# EAGLE design SiliconMind (EAGLE 8.3.2)
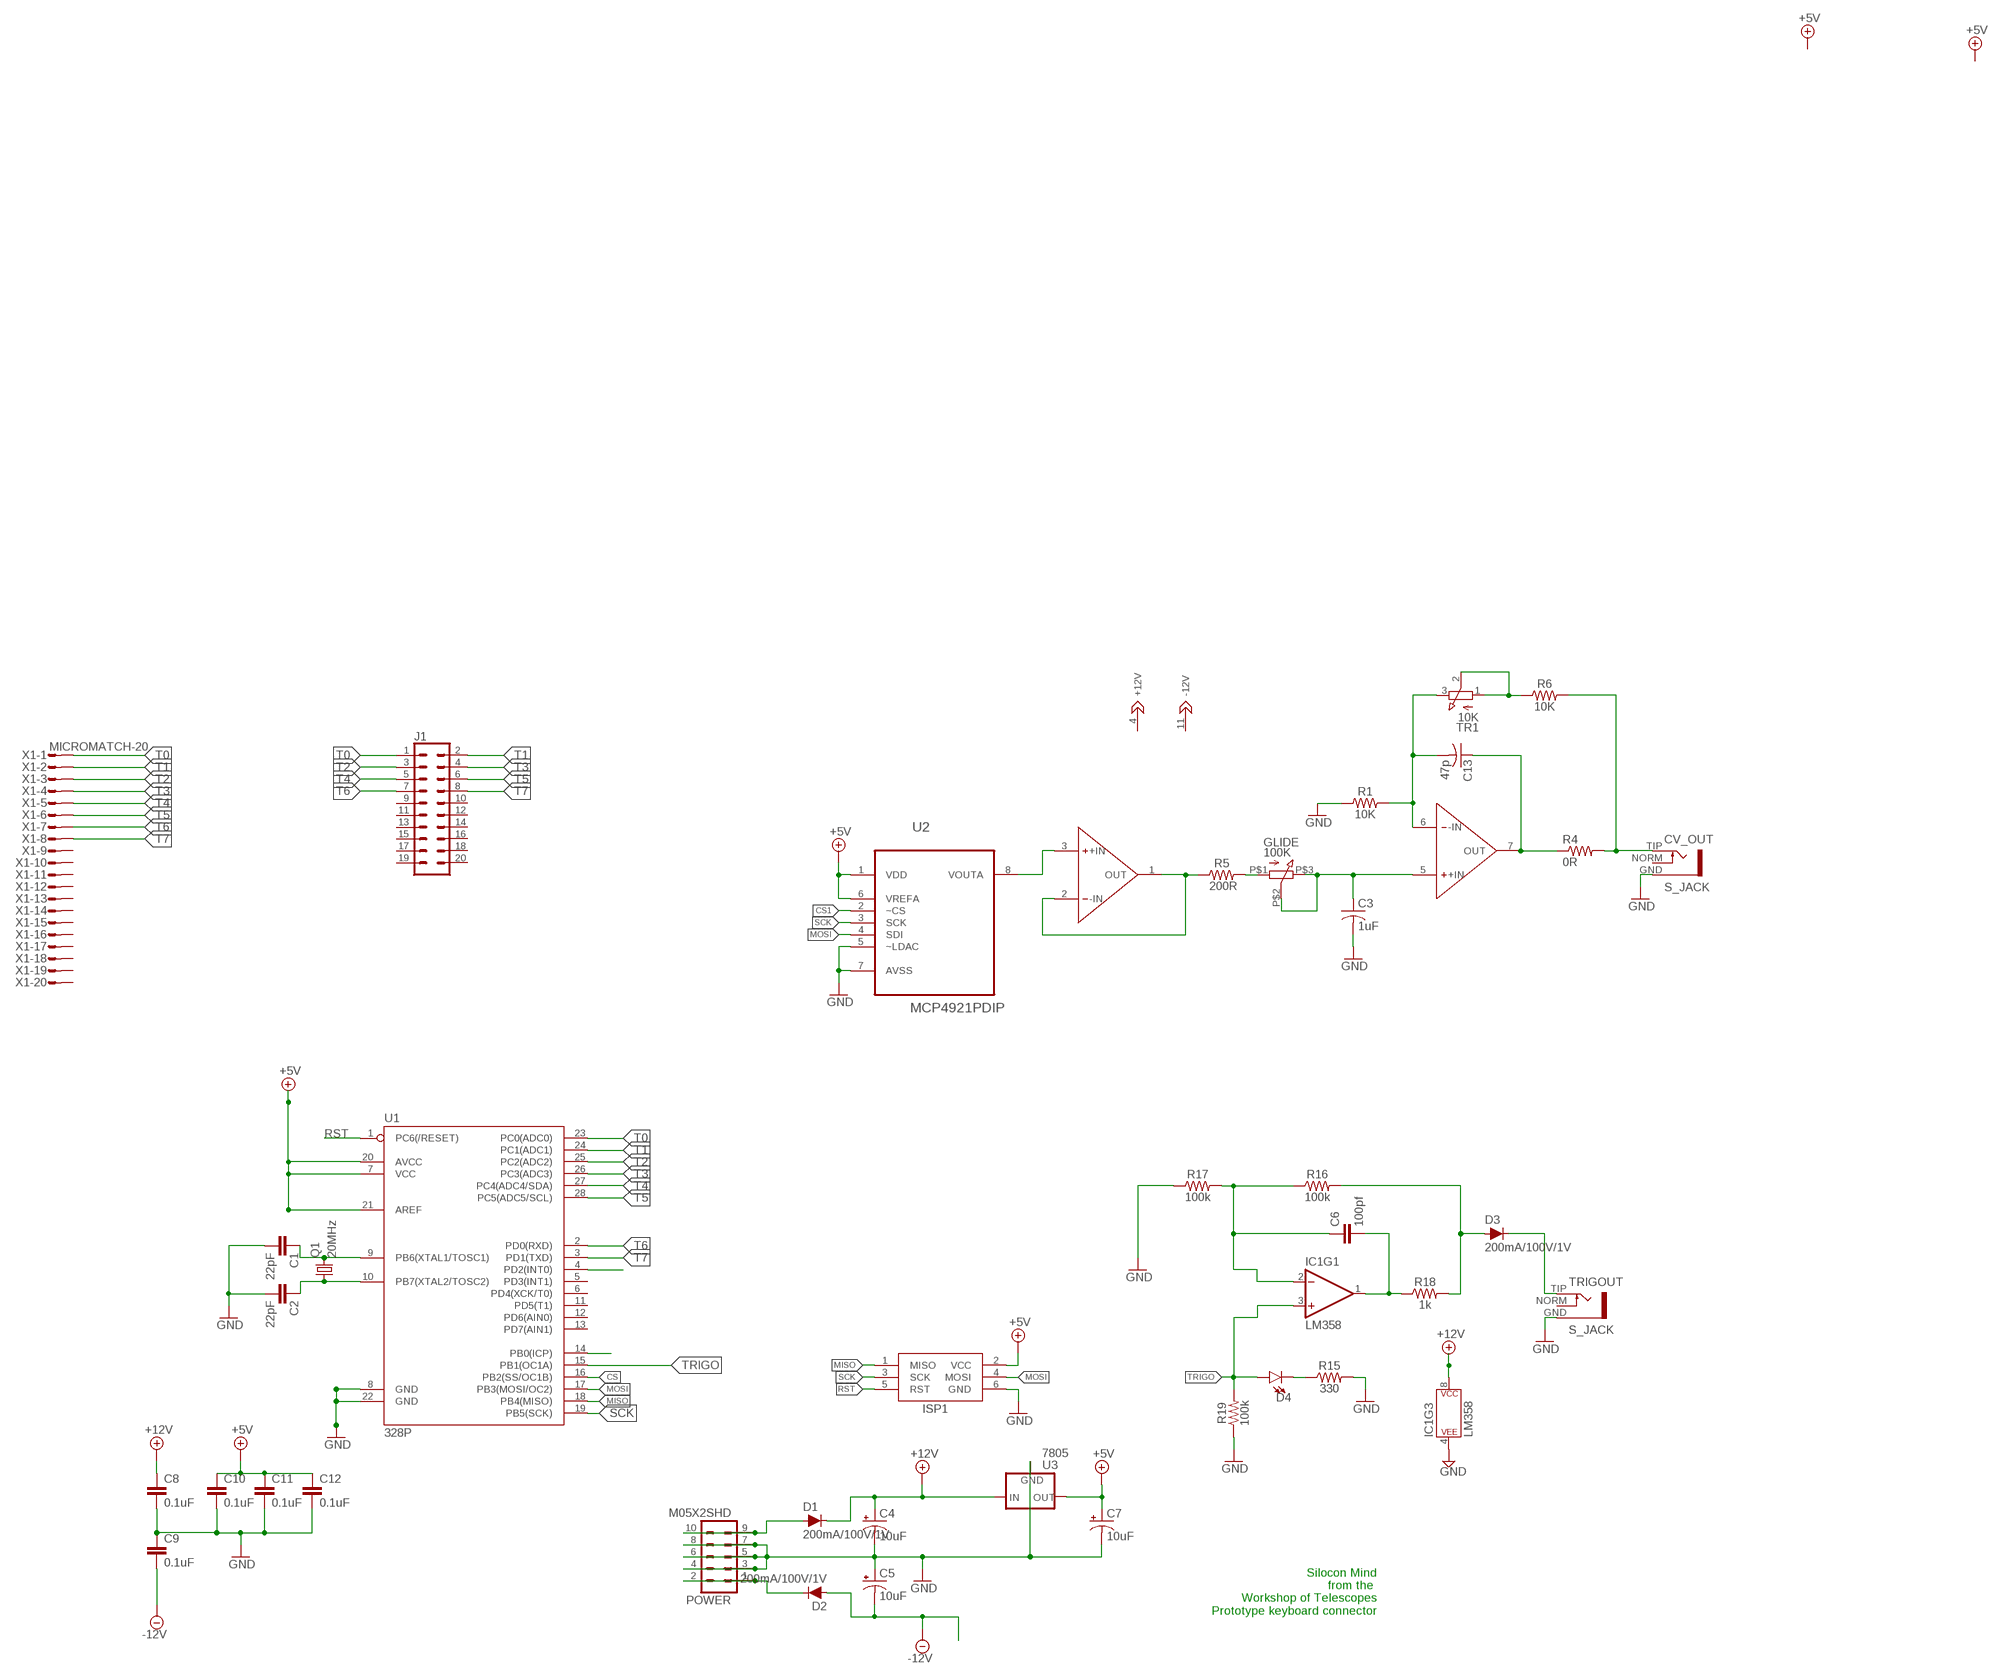
[diagram p0: schematic, sheet 1]

## Parts
C1  22pF  22PF-PTH-2.54MM-200V-5%  [CAP-PTH-2.54]
C2  22pF  22PF-PTH-2.54MM-200V-5%  [CAP-PTH-2.54]
C3  1uF  C-USC0805K  [C0805K]
C4  10uF  10UF-POLAR-RADIAL-2.5MM-25V-20%  [CPOL-RADIAL-2.5MM-5MM]
C5  10uF  10UF-POLAR-RADIAL-2.5MM-25V-20%  [CPOL-RADIAL-2.5MM-5MM]
C6  100pf  C-EU075-032X103  [C075-032X103]
C7  10uF  10UF-POLAR-RADIAL-2.5MM-25V-20%  [CPOL-RADIAL-2.5MM-5MM]
C8  0.1uF  0.1UF-KIT-EZ-50V-20%  [CAP-PTH-SMALL-KIT]
C9  0.1uF  0.1UF-KIT-EZ-50V-20%  [CAP-PTH-SMALL-KIT]
C10  0.1uF  0.1UF-KIT-EZ-50V-20%  [CAP-PTH-SMALL-KIT]
C11  0.1uF  0.1UF-KIT-EZ-50V-20%  [CAP-PTH-SMALL-KIT]
C12  0.1uF  0.1UF-KIT-EZ-50V-20%  [CAP-PTH-SMALL-KIT]
C13  47p  C-USC0805K  [C0805K]
CV_OUT  S_JACK  [S_JACK]
D1  200mA/100V/1V  DIODE-1N4148  [DIODE-1N4148]
D2  200mA/100V/1V  DIODE-1N4148  [DIODE-1N4148]
D3  200mA/100V/1V  DIODE-1N4148  [DIODE-1N4148]
D4  LED3MM  [LED_3MM]
GLIDE  100K  Q-POT  [Q-POT]
IC1  LM358  [DIP08]
ISP1  AVRISP-6  [AVRISP]
J1  CONN_10X2  [2X10]
POWER  M05X2SHD  [2X5-SHROUDED]
Q1  20MHz  CRYSTALHC49U70  [HC49U70]
R1  10K  RESISTORAXIAL-0.3  [AXIAL-0.3]
R4  0R  R-US_R0805  [R0805]
R5  200R  RESISTORAXIAL-0.3  [AXIAL-0.3]
R6  10K  RESISTORAXIAL-0.3  [AXIAL-0.3]
R15  330  330OHM-HORIZ-1/10W-5%  [AXIAL-0.3]
R16  100k  100KOHM-HORIZ-1/4W-5%  [AXIAL-0.3]
R17  100k  100KOHM-HORIZ-1/4W-5%  [AXIAL-0.3]
R18  1k  1KOHM-HORIZ-1/4W-5%  [AXIAL-0.3]
R19  100k  100KOHM-HORIZ-1/4W-5%  [AXIAL-0.3]
TR1  10K  TRIM_3269W  [TRIM_3269W]
TRIGOUT  S_JACK  [S_JACK]
U1  328P  ATMEGA328P_PDIP  [DIP28]
U2  MCP4921PDIP  [DIP08]
U3  7805  V_REG_78XX-TO-220  [TO-220-ALT]
U4  QUAD_OPAMPDIP14  [DIP254P762X533-14]
X1  MICROMATCH-20  [MICROMATCH-20]

## Nets
+5V [Power]: C7.1(+) C10.1 C11.1 C12.1 ISP1.2(VCC) U1.7(VCC) U1.20(AVCC) U1.21(AREF) U2.1(VDD) U2.6(VREFA) U3.OUT
+12V [Power]: C4.1(+) C8.1 D1.C IC1.8(P$V+) U3.IN
-12V [Power]: C5.2(-) C9.2 D2.A
BUTLED: U1.15(PB1(OC1A))
CS: U1.16(PB2(SS/OC1B))
CS1: U2.2(~CS)
GND [Power]: C1.2 C2.2 C3.2 C4.2(-) C5.1(+) C7.2(-) C8.2 C9.1 C10.2 C11.2 C12.2 CV_OUT.GND IC1.4(P$V-) ISP1.6(GND) POWER.3 POWER.4 POWER.5 POWER.6 POWER.7 POWER.8 R1.P$1 R15.P$2 R17.P$1 R19.P$1 TRIGOUT.GND U1.8(GND) U1.22(GND) U2.5(~LDAC) U2.7(AVSS) U3.GND
MISO: ISP1.1(MISO) U1.18(PB4(MISO))
MOSI: ISP1.4(MOSI) U1.17(PB3(MOSI/OC2)) U2.4(SDI)
N$1: C1.1 Q1.2 U1.9(PB6(XTAL1/TOSC1))
N$2: C2.1 Q1.1 U1.10(PB7(XTAL2/TOSC2))
N$3: U2.8(VOUTA) U4.3(+IN)
N$4: R5.P$1 U4.1(OUT) U4.2(-IN)
N$5: GLIDE.P$1 R5.P$2
N$6: C3.1 GLIDE.P$2 GLIDE.P$3 U4.5(+IN)
N$7: R6.P$1 TR1.1 TR1.2
N$8: CV_OUT.TIP R4.2 R6.P$2
N$9: D1.A POWER.9 POWER.10
N$10: D2.C POWER.1 POWER.2
N$11: C13.1 R4.1 U4.7(OUT)
N$12: C13.2 R1.P$2 TR1.3 U4.6(-IN)
N$17: U1.4(PD2(INT0))
N$31: D4.K(C) R15.P$1
N$32: C6.1 IC1.2(-IN) R16.P$1 R17.P$2
N$33: C6.2 IC1.1(OUT) R18.P$1
N$34: D3.A R16.P$2 R18.P$2
N$74: D3.C TRIGOUT.TIP
RST: ISP1.5(RST) U1.1(PC6(/RESET))
SCK: ISP1.3(SCK) U1.19(PB5(SCK)) U2.3(SCK)
T0: J1.1 U1.23(PC0(ADC0)) X1.1
T1: J1.2 U1.24(PC1(ADC1)) X1.2
T2: J1.3 U1.25(PC2(ADC2)) X1.3
T3: J1.4 U1.26(PC3(ADC3)) X1.4
T4: J1.5 U1.27(PC4(ADC4/SDA)) X1.5
T5: J1.6 U1.28(PC5(ADC5/SCL)) X1.6
T6: J1.7 U1.2(PD0(RXD)) X1.7
T7: J1.8 U1.3(PD1(TXD)) X1.8
TRIGO: D4.A IC1.3(+IN) R19.P$2 U1.14(PB0(ICP))
Unconnected: CV_OUT.NORM IC1.5(+IN) IC1.6(-IN) IC1.7(OUT) J1.9 J1.10 J1.11 J1.12 J1.13 J1.14 J1.15 J1.16 J1.17 J1.18 J1.19 J1.20 TRIGOUT.NORM U1.5(PD3(INT1)) U1.6(PD4(XCK/T0)) U1.11(PD5(T1)) U1.12(PD6(AIN0)) U1.13(PD7(AIN1)) U4.4(+12V) U4.8(OUT) U4.9(-IN) U4.10(+IN) U4.11(-12V) U4.12(+IN) U4.13(-IN) U4.14(OUT) X1.9 X1.10 X1.11 X1.12 X1.13 X1.14 X1.15 X1.16 X1.17 X1.18 X1.19 X1.20

## Notes on the sheet
- Silocon Mind
  from the 
  Workshop of Telescopes
  Prototype keyboard connector

## Library data of the parts
C1 C2 = SparkFun-Capacitors:22PF: 22pF ceramic capacitors A capacitor is a passive two-terminal electrical component used to store electrical energy temporarily in an electric field.; PROD_ID: CAP-09128
C3 C13 = rcl:C-US: CAPACITOR, American symbol
C4 C5 C7 = SparkFun-Capacitors:10UF-POLAR: 10.0µF polarized capacitors A capacitor is a passive two-terminal electrical component used to store electrical energy temporarily in an electric field.; PROD_ID: CAP-08440
C6 = rcl:C-EU: CAPACITOR, European symbol
C8-C12 = SparkFun-Capacitors:0.1UF: 0.1µF ceramic capacitors A capacitor is a passive two-terminal electrical component used to store electrical energy temporarily in an electric field.; PROD_ID: CAP-08370
CV_OUT TRIGOUT = INSTRUO:S_JACK
D1-D3 = SparkFun-DiscreteSemi:DIODE: Diode These are standard reverse protection diodes and small signal diodes. SparkFun Products: SparkFun SparkPunk Sound Kit <https://www.sparkfun.com/products/11177> SparkFun ESP8266 Thing <https://www.sparkfun.com/products/13231>; PROD_ID: DIO-08378
D4 = SparkFun-LED:LED: LED (Generic) Standard schematic elements and footprints for 5mm, 3mm, 1206, and 0603 sized LEDs. Generic LEDs with no color specified.; PROD_ID: DIO-08794
GLIDE = INSTRUO:Q-POT
IC1 = SparkFun-IC-Amplifiers:LM358: LM358 Jellybean op-amp Datasheet <http://www.sparkfun.com/datasheets/Components/General/LM358.pdf> SparkFun Products Op-Amp (Thru-Hole) - LM358 <https://www.sparkfun.com/products/9456> (COM-09456); PROD_ID: IC-09172
ISP1 = adafruit:AVRISP: AVR ISP HEADER Standard 6 pin header for AVR programming
J1 = SparkFun-Connectors:CONN_10X2: Multi connection point. Often used as Generic Header-pin footprint for 0.1 inch spaced/style header connections On any of the 0.1 inch spaced packages, you can populate with these: Break Away Headers - Straight <https://www.sparkfun.com/products/116> (PRT-00116) Break Away Male Headers - Right Angle <https://www.sparkfun.com/products/553> (PRT-00553) Female Headers <https://www.sparkfun.com/products/115> (PRT-00115) Break Away Headers - Machine Pin <https://www.sparkfun.com/products/117> (PRT-00117) Break Away Female Headers - Swiss Machine Pin <https://www.sparkfun.com/products/743> (PRT-00743) Special note about the "SPECIAL" package: This was SPECIALLY designed to be used with our Graphic LCD Backpack. Be sure you want to use this! It is not only staggered on each line of header holes, but IT IS ALSO offset of the center point of the top and bottom lines by 5 mil. This causes the headers to lock into place on the "standard" footprint on the LCD screen. The extra squares on the tdocu layer are there simply to reference other pins (if you were to actually populate a longer header than ten long - this is what we do with the backpacks).
POWER = SparkFun-Connectors:M05X2: Header 5x2 Standard 10-pin dual row 0.1" header. Commonly used with AVR-ISP. Use with Spark Fun Electronics SKU: PRT-00778
Q1 = adafruit:CRYSTAL: CRYSTAL; OC_FARNELL: unknown; OC_NEWARK: unknown
R1 R5 R6 = SparkFun-Resistors:RESISTOR: Generic Resistor Package
R4 = rcl:R-US_: RESISTOR, American symbol
R15 = SparkFun-Resistors:330OHM: 330Ω resistor A resistor is a passive two-terminal electrical component that implements electrical resistance as a circuit element. Resistors act to reduce current flow, and, at the same time, act to lower voltage levels within circuits. - Wikipedia; PROD_ID: RES-8371
R16 R17 R19 = SparkFun-Resistors:100KOHM: 100kΩ resistor A resistor is a passive two-terminal electrical component that implements electrical resistance as a circuit element. Resistors act to reduce current flow, and, at the same time, act to lower voltage levels within circuits. - Wikipedia; PROD_ID: RES-10686
R18 = SparkFun-Resistors:1KOHM: 1kΩ resistor A resistor is a passive two-terminal electrical component that implements electrical resistance as a circuit element. Resistors act to reduce current flow, and, at the same time, act to lower voltage levels within circuits. - Wikipedia; PROD_ID: RES-08380
TR1 = INSTRUO:TRIM_3269W: Manufacturer Part #: 3269W-1-101GLF
U1 = SparkFun-IC-Microcontroller:ATMEGA328P_PDIP: Atmel 328P Through hole ATMEGA328P uC used in the Arduino 32kb flash, 1k EEPROM, 2k SRAM Datasheet <http://www.sparkfun.com/datasheets/Components/SMD/ATMega328.pdf> SparkFun Products Storefront component: AVR 28 Pin 20MHz 32K 6A/D - ATMega328P <https://www.sparkfun.com/products/9061> (COM-09061) SparkFun Simon Says - Through-Hole Soldering Kit <https://www.sparkfun.com/products/10547> (KIT-10547) SparkFun Learn to Solder - Simon Says <https://www.sparkfun.com/products/13708> (KIT-13708) SparkFun BigTime Watch Kit <https://www.sparkfun.com/products/11734> (KIT-11734) SparkFun ClockIt <https://www.sparkfun.com/products/10930> (KIT-10930) SparkFun Serial Enabled LCD Kit <https://www.sparkfun.com/products/10097> (LCD-10097) SparkFun Simon Tilts - Through Hole Soldering Kit <https://www.sparkfun.com/products/12634> (KIT-12634) SparkFun Frequency Counter Kit <https://www.sparkfun.com/products/10140> (KIT-10140) FabFM Radio Kit <https://www.sparkfun.com/products/11043> (KIT-11043) SparkFun Binary Blaster Kit <https://www.sparkfun.com/products/12037> (KIT-12037) SparkFun Metro-Gnome <https://www.sparkfun.com/products/9236> (KIT-09236) ATmega328 with Arduino Optiboot (Uno) <https://www.sparkfun.com/products/10524> (DEV-10524); PROD_ID: IC-09136
U2 = INSTRUO:MCP4921
U3 = SparkFun-IC-Power:V_REG_78XX: Voltage Regulator Standard 78xx regulator. IGO (Input Ground Output). Spark Fun Electronics SKU : COM-00107; PROD_ID: VREG-08450; SF_ID: COM-00107
U4 = INSTRUO:QUAD_OPAMP
X1 = con-amp-micromatch:MICROMATCH-20: MicroMaTch 20 9-215464-0 / 2-215464-0 Drawing Number C-215464 DDEController.pdf; MF: FARNELL; MPN: 9-215464-0; OC_FARNELL: 3784708; OC_NEWARK: 19J6798

## Net classes
1 Power: width 0.8 mm

## Board
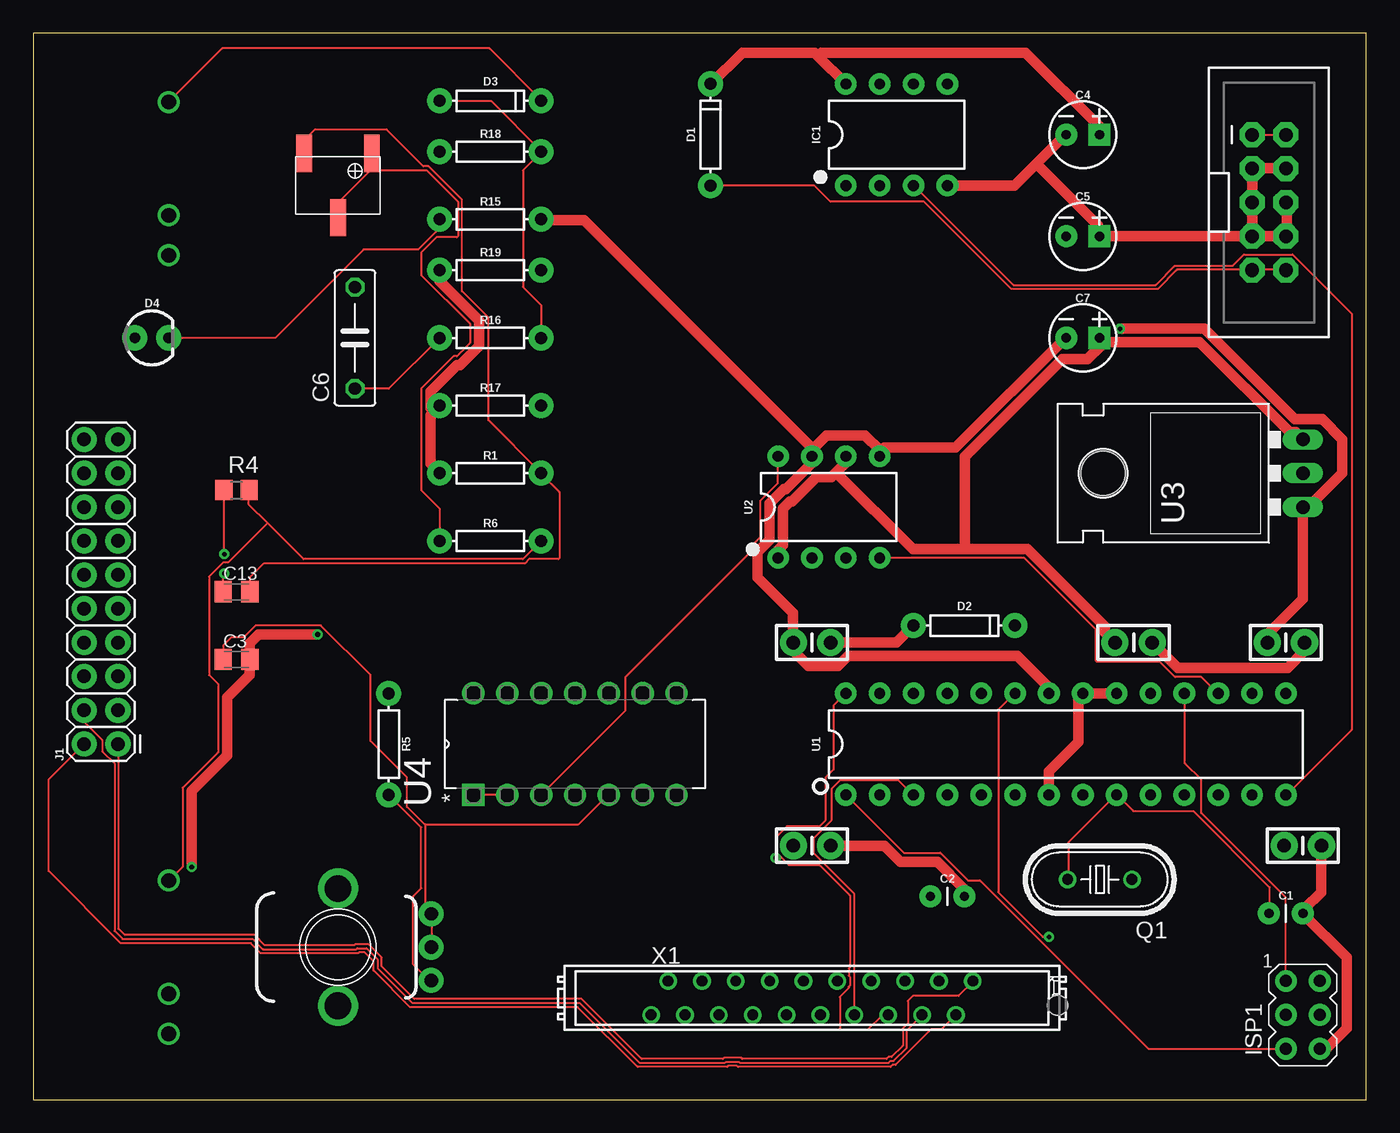
[diagram p1: board, top side]
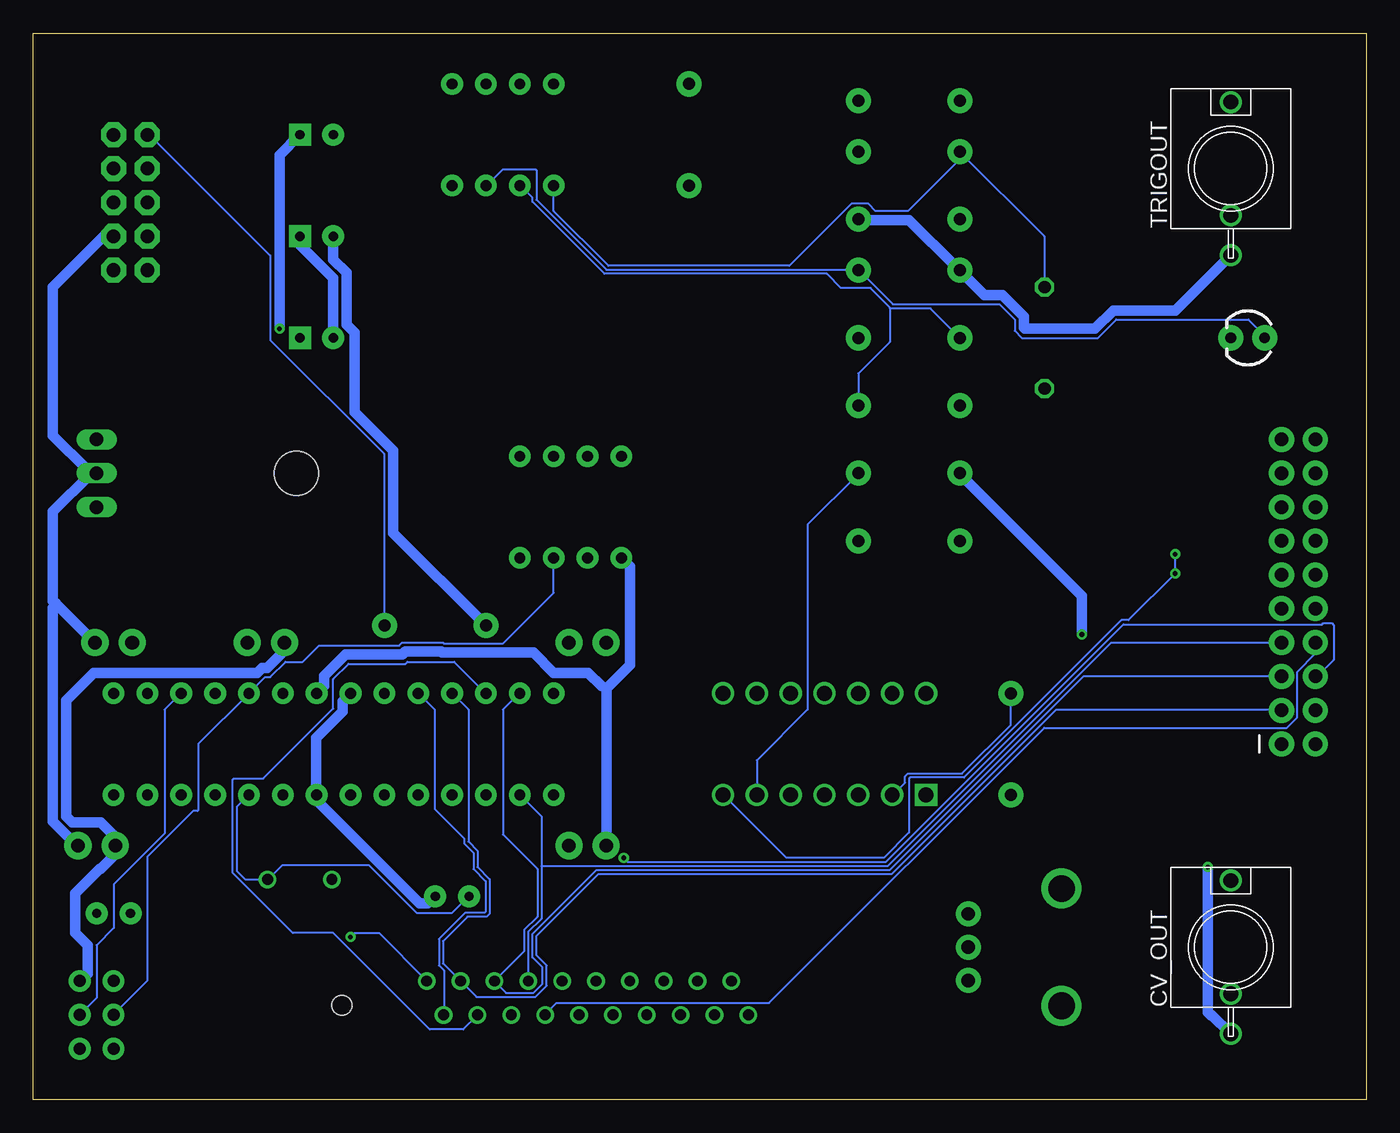
[diagram p2: board, bottom side, seen from below]

Size 100 x 80 mm. Coordinates in mm from the lower left corner, seen from the top.
Outline: 0,0 100,0 100,80 0,80 0,0
Copper layers (1*16): Top 0.035mm / dielectric 1.5mm / Bottom 0.035mm
Design rules "default": minimum track width 6mil, minimum drill 0.35mm, track to track 6mil, track to pad 6mil, pad to pad 6mil, via to via 6mil, smd to smd 6mil, copper to edge 40mil, drill to drill 6mil, minimum pad ring 10mil, minimum via ring 8mil, stop-mask expansion 4mil, vias tented up to drill 0mil, thermal gap 10mil

### Footprints (pad centres in the part's own frame; a part is rotated, then mirrored left to right if it is on the bottom)
CAP-PTH-2.54 = drill 0.7 pad 1.651: 1 -1.27,0; 2 1.27,0
C0805K = smd 1.3 x 1.6: 1 -1,0; 2 1,0
CPOL-RADIAL-2.5MM-5MM = drill 0.7 pad 1.651 square: 1 1.25,0 | drill 0.7 pad 1.651: 2 -1.25,0
C075-032X103 = drill 0.914 octagon: 1 -3.81,0; 2 3.81,0
CAP-PTH-SMALL-KIT = drill 1.016 pad 2.032: 1 -1.397,0; 2 1.397,0
S_JACK = drill 1.1: GND 0,-6.5; NORM 0,-3.5; TIP 0,5
DIODE-1N4148 = drill 0.9 pad 1.88: A -3.81,0; C 3.81,0
LED_3MM = drill 0.813 pad 1.88: A -1.27,0; K 1.27,0
Q-POT = drill 1 pad 1.88: P$1 -2.5,-7; P$2 0,-7; P$3 2.5,-7 | drill 2 pad 2.68: P$4 -4.4,0; P$5 4.4,0
DIP08 = drill 0.813 pad 1.626: 1 -3.81,-3.81; 2 -1.27,-3.81; 3 1.27,-3.81; 4 3.81,-3.81; 5 3.81,3.81; 6 1.27,3.81; 7 -1.27,3.81; 8 -3.81,3.81
AVRISP = drill 0.9 pad 1.626: 1 -1.27,2.54; 2 1.27,2.54; 3 -1.27,0; 4 1.27,0; 5 -1.27,-2.54; 6 1.27,-2.54
2X10 = drill 1.016 pad 1.88: 1 0,0; 2 0,2.54; 3 2.54,0; 4 2.54,2.54; 5 5.08,0; 6 5.08,2.54; 7 7.62,0; 8 7.62,2.54; 9 10.16,0; 10 10.16,2.54; 11 12.7,0; 12 12.7,2.54; 13 15.24,0; 14 15.24,2.54; 15 17.78,0; 16 17.78,2.54; 17 20.32,0; 18 20.32,2.54; 19 22.86,0; 20 22.86,2.54
2X5-SHROUDED = drill 1.016 pad 1.88 octagon: 1 -1.27,5.08; 2 1.27,5.08; 3 -1.27,2.54; 4 1.27,2.54; 5 -1.27,0; 6 1.27,0; 7 -1.27,-2.54; 8 1.27,-2.54; 9 -1.27,-5.08; 10 1.27,-5.08
HC49U70 = drill 0.813: 1 -2.413,0; 2 2.413,0
AXIAL-0.3 = drill 0.9 pad 1.88: P$1 -3.81,0; P$2 3.81,0
R0805 = smd 1.3 x 1.5: 1 -0.95,0; 2 0.95,0
TRIM_3269W = smd 1.19 x 2.79: 1 2.54,2.414; 2 0,-2.414; 3 -2.54,2.414
DIP28 = drill 0.813 pad 1.626: 1 -16.51,-3.81; 2 -13.97,-3.81; 3 -11.43,-3.81; 4 -8.89,-3.81; 5 -6.35,-3.81; 6 -3.81,-3.81; 7 -1.27,-3.81; 8 1.27,-3.81; 9 3.81,-3.81; 10 6.35,-3.81; 11 8.89,-3.81; 12 11.43,-3.81; 13 13.97,-3.81; 14 16.51,-3.81; 15 16.51,3.81; 16 13.97,3.81; 17 11.43,3.81; 18 8.89,3.81; 19 6.35,3.81; 20 3.81,3.81; 21 1.27,3.81; 22 -1.27,3.81; 23 -3.81,3.81; 24 -6.35,3.81; 25 -8.89,3.81; 26 -11.43,3.81; 27 -13.97,3.81; 28 -16.51,3.81
TO-220-ALT = drill 1.016 long: GND 0,-3.81; IN -2.54,-3.81; OUT 2.54,-3.81 | hole 3.302: 0,11.176
DIP254P762X533-14 = drill 1.118 square: 1 -7.62,15.24 | drill 1.118: 2 -7.62,12.7; 3 -7.62,10.16; 4 -7.62,7.62; 5 -7.62,5.08; 6 -7.62,2.54; 7 -7.62,0; 8 0,0; 9 0,2.54; 10 0,5.08; 11 0,7.62; 12 0,10.16; 13 0,12.7; 14 0,15.24
MICROMATCH-20 = drill 0.813: 1 12.065,1.27; 2 10.795,-1.27; 3 9.525,1.27; 4 8.255,-1.27; 5 6.985,1.27; 6 5.715,-1.27; 7 4.445,1.27; 8 3.175,-1.27; 9 1.905,1.27; 10 0.635,-1.27; 11 -0.635,1.27; 12 -1.905,-1.27; 13 -3.175,1.27; 14 -4.445,-1.27; 15 -5.715,1.27; 16 -6.985,-1.27; 17 -8.255,1.27; 18 -9.525,-1.27; 19 -10.795,1.27; 20 -12.065,-1.27 | hole 1.5: 18.43,-0.55

### Placement (x,y rotation side)
C1  93.98,13.97 0 top
C2  68.58,15.24 0 top
C3  15.24,33.02 0 top
C4  78.74,72.39 0 top
C5  78.74,64.77 0 top
C6  24.13,57.15 90 top
C7  78.74,57.15 0 top
C8  93.98,34.29 0 top
C9  58.42,34.29 0 top
C10  58.42,19.05 0 top
C11  95.25,19.05 0 top
C12  82.55,34.29 0 top
C13  15.24,38.1 0 top
CV_OUT  10.16,11.43 0 bottom
D1  50.8,72.39 90 top
D2  69.85,35.56 0 top
D3  34.29,74.93 0 top
D4  8.89,57.15 0 top
GLIDE  22.86,11.43 90 top
IC1  64.77,72.39 0 top
ISP1  95.25,6.35 0 top
J1  6.35,26.67 90 top
POWER  92.71,67.31 0 top
Q1  80.01,16.51 180 top
R1  34.29,46.99 0 top
R4  15.24,45.72 0 top
R5  26.67,26.67 270 top
R6  34.29,41.91 0 top
R15  34.29,66.04 0 top
R16  34.29,57.15 0 top
R17  34.29,52.07 0 top
R18  34.29,71.12 0 top
R19  34.29,62.23 0 top
TR1  22.86,68.58 0 top
TRIGOUT  10.16,69.85 0 bottom
U1  77.47,26.67 0 top
U2  59.69,44.45 0 top
U3  91.44,46.99 90 top
U4  48.26,30.48 90 top
X1  58.42,7.62 0 top

### Tracks (layer width: path | path; a pad name or v marks a point on that pad's centre or on a via)
+5V
  Top 0.8: U3.OUT 94.72,50.06 94.26,50.06 87.48,56.84 80.31,56.84 80.01,57.15 C7.1 80.09,56.54 79.1,55.55 77.19,55.55 69.88,48.23 69.88,41.3 | U1.7 76.2,24.61 78.41,26.82 78.41,30.18 78.72,30.48 U1.21 U1.20 | 60.24,47.05 60.96,47.78 U2.6 | 60.24,47.05 59.89,46.71 58.75,46.71 56.92,44.88 56.77,44.88 56.24,44.35 56.24,41.6 55.85,41.22 55.85,40.69 U2.1 | C12.1 80.39,35.05 80.39,35.51 74.6,41.3 69.88,41.3 | 69.88,41.3 65.99,41.3 60.24,47.05
  Bottom 0.8: ISP1.2 96.47,8.91 95.94,9.45 95.94,11.58 96.85,12.5 96.85,15.47 95.02,17.3 94.94,17.3 93.88,18.36 93.88,19.05 C11.1 94.03,19.43 94.03,19.89 94.94,20.8 97.08,20.8 97.54,21.26 97.54,29.95 95.48,32 83.21,32 82.83,32.38 82.45,32.38 81.15,33.68 C12.1 | 57,30.86 57,19.05 C10.1 | 57,30.86 55.24,32.61 55.24,40.01 U2.1 | U1.21 78.72,30.48 78.18,31.01 78.18,31.77 76.58,33.38 72.31,33.38 72.08,33.6 69.42,33.6 69.34,33.53 62.48,33.53 60.96,32 58.37,32 57.38,31.01 57,30.86
+12V  (via drill 0.35)
  Top 0.8: C8.1 92.58,34.9 95.25,37.57 U3.IN 95.63,44.58 95.78,44.58 98.22,47.02 98.22,49.53 96.7,51.05 94.64,51.05 87.86,57.84 v81.53,57.84 | 58.86,78.3 58.6,78.56 53.19,78.56 50.83,76.2 D1.C | 58.86,78.3 IC1.8 | C4.1 79.93,72.39 79.93,73.08 74.45,78.56 59.13,78.56 58.86,78.3
  Bottom 0.8: v81.53,57.84 81.53,70.87 80.01,72.39 C4.1
-12V
  Top 0.8: C9.2 64.77,34.29 D2.A
  Bottom 0.8: D2.A 73,42.52 73,48.69 75.89,51.59 75.89,57.53 76.5,58.14 76.5,62.03 77.5,63.02 C5.2
GND  (via drill 0.35)
  Top 0.8: v21.34,34.9 16.92,34.9 16.23,34.21 16.23,33.07 C3.2 16.23,32.61 16.23,31.85 14.55,30.18 14.55,25.83 11.89,23.16 v11.89,17.45 | R1.P$1 30.48,47.02 29.79,47.7 29.79,51.36 30.48,52.05 R17.P$1 29.79,51.89 29.79,53.11 31.77,55.09 32,55.09 33.45,56.54 33.45,58.45 30.48,61.42 R19.P$1 | ISP1.6 97,3.81 98.53,5.33 98.53,10.67 95.25,13.95 C1.2 95.4,14.33 96.62,15.54 96.62,19.05 C11.2 | C12.2 83.97,34.29 85.88,32.38 94.11,32.38 95.33,33.6 95.33,34.29 C8.2 | C10.2 63.86,19.05 65.08,17.83 67.82,17.83 69.8,15.85 69.8,15.24 C2.2 | 58.45,48.77 58.45,48.31 U2.7 58.37,47.85 58.37,47.7 56.46,45.8 56.31,45.8 55.24,44.73 55.24,41.99 54.33,41.07 54.33,39.17 57,36.5 57,34.29 C9.1 57.15,33.91 57.15,33.53 58.14,32.54 60.35,32.54 61.11,33.3 73.84,33.3 76.2,30.94 U1.22 | 58.45,48.77 59.51,49.84 62.41,49.84 63.48,48.77 63.48,48.31 U2.5 63.86,48.92 69.19,48.92 77.42,57.15 C7.2 | IC1.4 73.61,68.58 75.25,70.22 | 75.25,70.22 77.42,72.39 C4.2 | POWER.7 POWER.5 POWER.3 91.82,69.88 93.95,69.88 POWER.4 | POWER.7 POWER.8 94.03,65.15 94.03,67.28 POWER.6 | POWER.7 C5.1 79.86,65.15 79.86,65.61 75.25,70.22 | R15.P$2 38.1,65.99 41.3,65.99 58.22,49.07 58.45,48.77
  Bottom 0.8: TRIGOUT.GND 10.21,63.32 14.33,59.21 18.97,59.21 20.34,57.84 25.6,57.84 25.68,57.91 25.68,58.75 27.28,60.35 28.65,60.35 30.48,62.18 R19.P$1 30.79,62.48 34.29,65.99 38.1,65.99 R15.P$2 | v21.34,34.9 21.34,37.8 30.48,46.94 R1.P$1 | v11.89,17.45 11.89,6.55 11.66,6.33 11.58,6.33 10.21,4.95 CV_OUT.GND | 98.26,37.15 95.4,34.29 C8.2 | 98.26,37.15 98.53,37.41 98.53,44.12 95.71,46.94 95.25,46.94 U3.GND 95.94,47.24 98.53,49.84 98.53,60.96 94.72,64.77 POWER.8 | C11.2 96.7,19.05 98.53,20.88 98.53,36.88 98.26,37.15 | U1.22 76.81,29.87 76.81,29.11 78.79,27.13 78.79,22.86 U1.8 78.56,22.48 78.56,22.25 71.02,14.71 70.41,14.71 69.88,15.24 C2.2 | C7.2 77.5,61.65 79.93,64.08 79.93,64.77 C5.1
MISO
  Top 0.152: U1.18 86.41,30.48 86.41,25.22 87.63,24 87.63,21.49 93.95,15.16 93.95,8.91 ISP1.1
MOSI
  Top 0.152: U2.4 63.55,40.62 74.37,40.62 79.7,35.28 79.7,32.92 79.78,32.84 84.51,32.84 85.65,31.7 87.63,31.7 88.85,30.48 U1.17
  Bottom 0.152: ISP1.4 95.25,7.62 95.25,11.58 93.95,12.88 93.95,16.15 90.14,19.96 90.14,29.26 88.92,30.48 U1.17
N$1
  Top 0.152: Q1.2 77.65,16.54 77.65,19.28 81.23,22.86 U1.9 81.31,22.86 82.53,21.64 87.02,21.64 92.73,15.93 92.73,14.02 C1.1
N$2
  Bottom 0.152: U1.10 84.73,21.95 84.73,17.14 84.12,16.54 82.45,16.54 Q1.1 82.37,16.54 81.31,17.6 74.83,17.6 71.25,14.02 68.58,14.02 67.36,15.24 C2.1
N$3
  Top 0.152: U4.3 44.42,29.18 44.42,31.7 53.65,40.92 53.65,41.3 54.56,42.22 54.56,44.96 55.85,46.25 55.85,48.23 U2.8
N$4
  Top 0.152: U4.2 U4.1
  Bottom 0.152: R5.P$1 26.67,28.12 30.33,24.46 34.37,24.46 34.59,24.23 34.59,23.77 35.51,22.86 U4.2
N$5
  Top 0.152: R5.P$2 29.11,20.42 29.11,15.85 28.5,15.24 28.5,10.13 29.64,8.99 29.79,8.99 GLIDE.P$1
N$6
  Top 0.152: 29.38,20.61 29.41,20.57 29.41,14.33 29.79,13.95 GLIDE.P$3 29.87,13.87 GLIDE.P$2 | 29.38,20.61 28.04,21.95 28.04,24.16 25.3,26.9 25.3,31.85 21.57,35.59 16.69,35.59 15.77,34.67 14.86,34.67 14.25,34.06 14.25,33.07 C3.1 | U4.5 43.13,22.86 40.92,20.65 29.41,20.65 29.38,20.61
N$7
  Top 0.152: TR1.2 22.86,67.28 25.38,69.8 25.38,70.94 TR1.1 25.38,69.72 29.49,69.72 31.85,67.36 31.85,64.77 31.77,64.69 30.25,64.69 29.11,63.55 29.11,61.87 32.77,58.22 32.77,56.77 31.77,55.78 31.55,55.78 29.11,53.34 29.11,45.72 30.48,44.35 R6.P$1
N$8
  Top 0.152: 17.56,43.24 20.27,40.54 36.73,40.54 R6.P$2 | 17.56,43.24 16.15,44.65 16.15,45.72 R4.2 | 17.56,43.24 14.63,40.31 14.25,40.31 13.18,39.24 13.18,31.85 13.87,31.17 13.87,26.06 11.2,23.39 11.2,17.45 10.21,16.46 CV_OUT.TIP
N$9
  Top 0.152: 91.44,62.26 93.95,62.26 POWER.10 | D1.A 58.6,68.58 59.82,67.36 66.83,67.36 73.38,60.81 84.35,60.81 85.8,62.26 91.44,62.26 | 91.44,62.26 POWER.9
N$10
  Top 0.152: POWER.1 POWER.2
  Bottom 0.152: POWER.1 91.29,72.39 82.22,63.32 82.22,57 73.69,48.46 73.69,35.59 D2.C
N$11  (via drill 0.35)
  Top 0.152: v14.33,40.92 14.33,45.72 R4.1 | v14.33,39.47 14.33,39.4 14.25,39.32 C13.1
  Bottom 0.152: v14.33,40.92 v14.33,39.47 17.83,35.97 18.36,35.97 30.18,24.16 34.21,24.16 34.29,24.08 34.29,20.04 36.2,18.14 43.51,18.14 48.23,22.86 U4.7
N$12
  Top 0.152: C13.2 16.23,39.17 17.3,40.23 36.88,40.23 37.19,40.54 39.4,40.54 39.47,40.62 39.47,45.57 38.1,46.94 R1.P$2 38.1,47.02 34.14,50.98 34.14,58.67 32.16,60.66 32.16,67.51 29.64,70.03 29.26,70.03 26.52,72.77 21.11,72.77 20.34,72.01 20.34,71.02 TR1.3
  Bottom 0.152: U4.6 45.72,25.45 41.91,29.26 41.91,43.13 38.1,46.94 R1.P$2
N$31
  Top 0.152: D4.K 18.14,57.15 24.77,63.78 28.88,63.78 30.48,65.38 R15.P$1
N$32
  Top 0.152: C6.1 26.67,53.34 R16.P$1
  Bottom 0.152: 35.7,59.4 35.66,59.36 32.69,59.36 R16.P$1 | 35.7,59.4 37.19,60.88 39.4,60.88 40.46,61.95 57.15,61.95 62.56,67.36 62.56,67.67 63.48,68.58 IC1.2 | R17.P$2 38.1,54.48 35.74,56.84 35.74,59.36 35.7,59.4
N$33
  Bottom 0.152: C6.2 24.16,60.96 24.16,64.77 30.48,71.09 R18.P$1 30.25,70.79 34.37,66.67 36.8,66.67 37.34,67.21 38.63,67.21 43.28,62.56 56.84,62.56 60.96,66.67 IC1.1
N$34
  Top 0.152: D3.A 30.48,74.91 34.37,74.91 38.1,71.17 R18.P$2 38.1,71.09 36.73,69.72 36.73,60.96 38.1,59.59 R16.P$2
N$74
  Top 0.152: TRIGOUT.TIP 10.21,74.91 14.17,78.87 34.21,78.87 38.1,74.98 D3.C
RST
  Top 0.152: ISP1.5 83.67,3.81 71.02,16.46 70.1,16.46 68.05,18.52 65.3,18.52 U1.1
SCK
  Bottom 0.152: U2.3 60.96,38.02 64.77,34.21 69.19,34.21 69.27,34.29 72.31,34.29 72.54,34.06 78.56,34.06 79.78,32.84 81.08,32.84 82.22,31.7 82.6,31.7 U1.19 87.63,26.67 87.63,21.72 87.71,21.64 88.01,21.64 91.44,18.21 91.44,8.91 93.95,6.4 ISP1.3
T0  (via drill 0.35)
  Top 0.152: v76.2,12.19 75.74,12.19 72.39,15.54 72.39,29.26 73.61,30.48 U1.23 | J1.1 6.4,26.67 6.4,12.8 6.86,12.34 16.61,12.34 17.37,11.58 24.08,11.58 24.16,11.66 25.15,11.66 26.14,10.67 26.14,9.98 28.57,7.54 41.15,7.54 45.64,3.05 51.74,3.05 51.82,3.12 53.11,3.12 53.19,3.05 64.01,3.05 64.16,3.2 64.39,3.2 65.23,4.04 65.23,5.33 65.61,5.71 65.61,7.39 65.99,7.77 69.42,7.77 70.48,8.84 X1.1
  Bottom 0.152: v76.2,12.19 75.89,12.5 74.07,12.5 70.48,8.91 X1.1
T1
  Top 0.152: J1.2 1.14,24 1.14,17.14 6.55,11.73 16.31,11.73 17.07,10.97 24.38,10.97 24.46,11.05 24.84,11.05 25.53,10.36 25.53,9.68 28.27,6.93 40.84,6.93 45.34,2.44 52.05,2.44 52.12,2.52 52.81,2.52 52.88,2.44 64.31,2.44 64.47,2.59 64.69,2.59 67.36,5.26 68.12,5.26 X1.2
  Bottom 0.152: X1.2 69.19,6.4 69.19,9.68 69.57,10.06 69.57,12.04 67.59,14.02 66.14,14.02 66.06,14.1 66.06,16.38 66.98,17.3 66.98,18.52 67.67,19.2 67.67,19.58 69.88,21.79 69.88,29.26 71.09,30.48 U1.24
T2
  Bottom 0.152: U1.25 67.36,29.26 67.36,19.36 66.67,18.67 66.67,17.45 65.76,16.54 65.76,13.95 65.99,13.72 67.44,13.72 69.27,11.89 69.27,10.21 X1.3 66.75,7.7 62.33,7.7 61.49,8.53 61.49,10.06 62.26,10.82 62.26,12.27 57.61,16.92 35.59,16.92 23.24,29.26 6.4,29.26 J1.3
T3
  Top 0.152: J1.4 3.81,28.35 5.18,26.98 5.18,26.14 6.1,25.22 6.1,12.65 6.71,12.04 16.46,12.04 17.22,11.28 24.23,11.28 24.31,11.35 24.99,11.35 25.83,10.52 25.83,9.83 28.42,7.24 41,7.24 45.49,2.74 51.89,2.74 51.97,2.82 52.96,2.82 53.03,2.74 64.16,2.74 64.31,2.9 64.54,2.9 65.53,3.89 65.53,5.18 66.67,6.33 X1.4
  Bottom 0.152: U1.26 66.06,30.48 68.43,32.84 71.93,32.84 72.08,32.69 76.35,32.69 77.5,31.55 77.5,29.34 82.75,24.08 84.96,24.08 85.04,24 85.04,16.99 80.54,12.5 77.5,12.5 70.26,5.26 67.74,5.26 66.67,6.33 X1.4
T4
  Bottom 0.152: U1.27 63.55,30.48 64.77,29.26 64.77,19.89 62.18,17.3 62.18,13.72 63.17,12.72 63.17,11.12 X1.5 65.38,8.84 64.54,8 62.48,8 61.8,8.69 61.8,9.91 62.56,10.67 62.56,12.42 57.76,17.22 35.74,17.22 21.18,31.77 6.4,31.77 J1.5
T5  (via drill 0.35)
  Top 0.152: 55.93,18.36 55.78,18.52 55.78,19.74 56.54,20.5 58.98,20.5 59.44,20.95 59.44,24.16 60.05,24.77 60.05,29.57 U1.28 | 55.93,18.36 56.69,17.6 58.98,17.6 61.27,15.32 61.27,9.91 61.19,9.83 61.19,9.3 61.27,9.22 61.27,8.53 61.19,8.46 61.19,8.38 60.5,7.7 60.5,5.33 60.58,5.26 62.64,5.26 63.7,6.33 64.08,6.33 X1.6 | 55.93,18.36 v55.7,18.14
  Bottom 0.152: v55.7,18.14 55.4,17.83 36.04,17.83 18.21,35.66 3.28,35.66 3.2,35.74 2.59,35.74 2.44,35.59 2.44,32.99 3.66,31.77 3.81,31.77 J1.6
T6
  Bottom 0.152: X1.7 62.87,12.57 61.87,13.56 61.87,17.53 | 61.87,17.53 61.87,21.26 63.48,22.86 U1.2 | J1.7 19.13,34.29 35.89,17.53 61.87,17.53
T7
  Top 0.152: X1.8 61.57,6.4 61.57,15.47 58.52,18.52 58.52,19.58 59.89,20.95 59.89,23.32 60.5,23.93 64.92,23.93 65.99,22.86 U1.3
  Bottom 0.152: J1.8 3.81,33.45 5.18,32.08 5.18,28.65 5.94,27.89 24.16,27.89 44.81,7.24 60.73,7.24 61.57,6.4 X1.8
TRIGO
  Top 0.152: U1.14 94.03,22.86 98.91,27.74 98.91,58.98 94.49,63.4 90.83,63.4 89.99,62.56 85.65,62.56 84.2,61.11 73.53,61.11 66.06,68.58 IC1.3
  Bottom 0.152: D4.A 7.62,57.3 8.84,58.52 18.75,58.52 20.12,57.15 25.83,57.15 26.36,57.68 26.36,58.52 27.51,59.66 35.51,59.66 38.1,62.26 | 38.1,62.26 57,62.26 62.26,67.51 62.26,69.72 62.33,69.8 64.77,69.8 65.99,68.58 IC1.3 | 38.1,62.26 R19.P$2